# Altium schematic sheet 2_shkb_lite_mini_bt_hub.SchDoc: =ProjectTitle
size A4; Address1: github.com/4pplet/SHKB; Address2: Licence: CERN-OHL-S; SheetNumber: 2; SheetTotal: 7
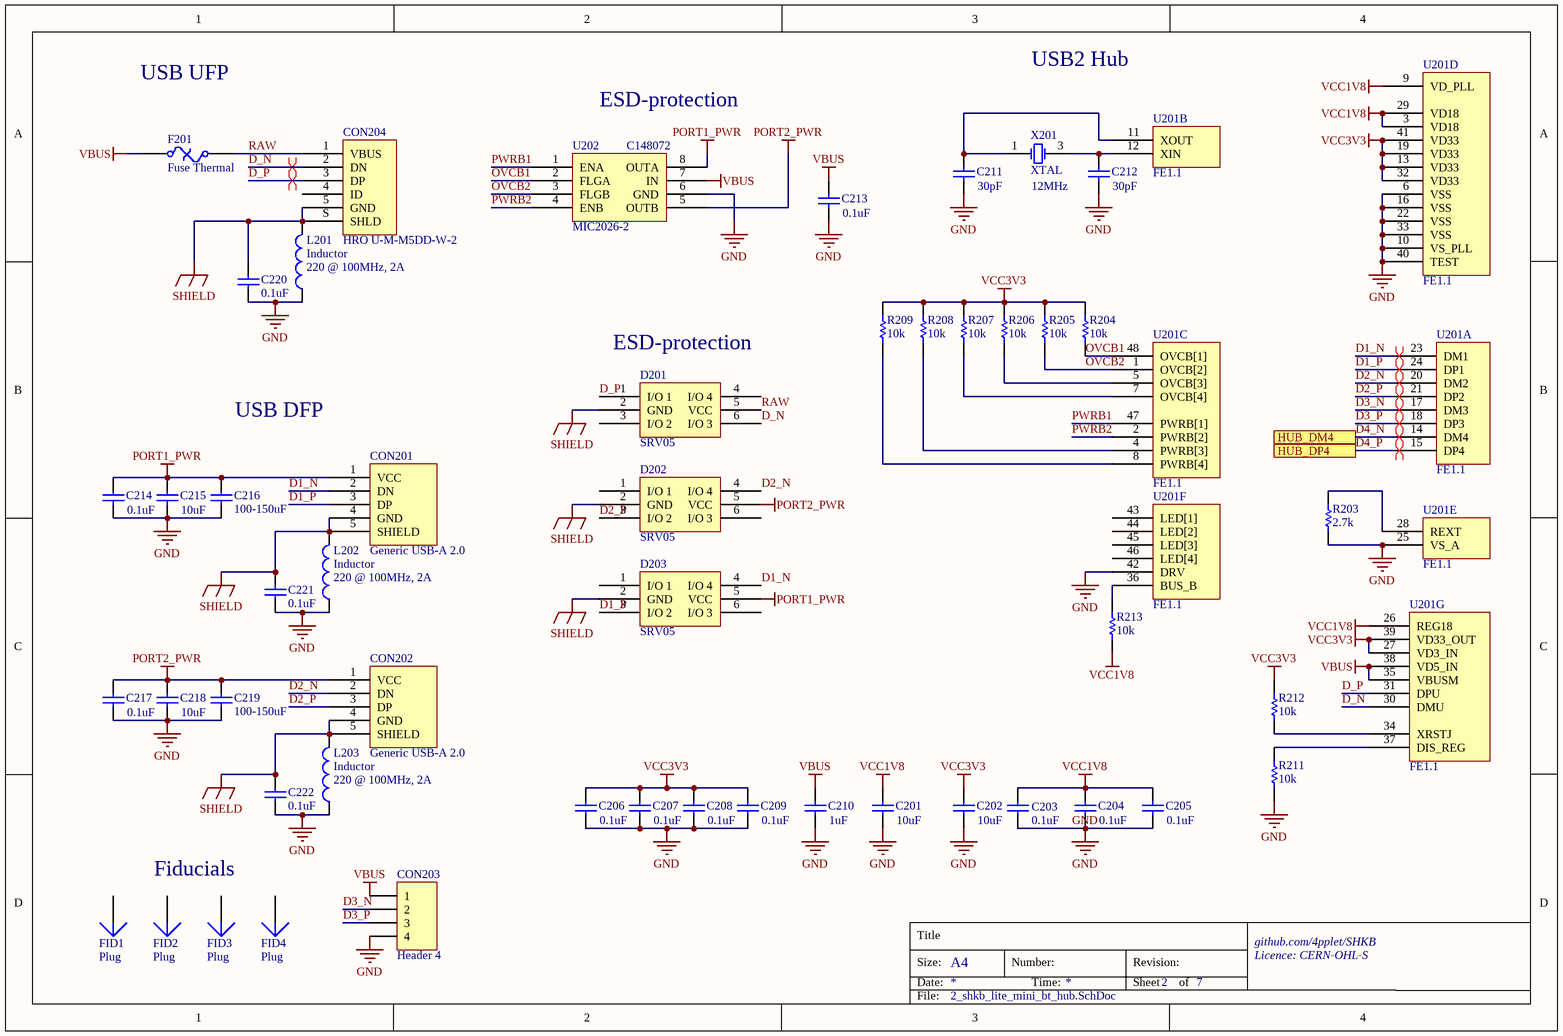
[diagram p0: 2_shkb_lite_mini_bt_hub.SchDoc]

## Parts
C201  value 10uF  [C0603[1608]]
C202  value 10uF  [C0603[1608]]
C203  value 0.1uF  [C0603[1608]]
C204  value 0.1uF  [C0603[1608]]
C205  value 0.1uF  [C0603[1608]]
C206  value 0.1uF  [C0603[1608]]
C207  value 0.1uF  [C0603[1608]]
C208  value 0.1uF  [C0603[1608]]
C209  value 0.1uF  [C0603[1608]]
C210  value 1uF  [C0603[1608]]
C211  value 30pF  [C0603[1608]]
C212  value 30pF  [C0603[1608]]
C213  value 0.1uF  [C0603[1608]]
C214  value 0.1uF  [C0603[1608]]
C215  value 10uF  [C0603[1608]]
C216  value 100-150uF  [C_9L_9M + THT]
C217  value 0.1uF  [C0603[1608]]
C218  value 10uF  [C0603[1608]]
C219  value 100-150uF  [C_9L_9M + THT]
C220  value 0.1uF  [C0603[1608]]
C221  value 0.1uF  [C0603[1608]]
C222  value 0.1uF  [C0603[1608]]
CON201  Generic USB-A 2.0  [Jing 903-231A2031S10100]
CON202  Generic USB-A 2.0  [Jing 903-231A2031S10100]
CON203  Header 4  [HDR1X4]  (no BOM)
CON204  HRO U-M-M5DD-W-2  [HRO U-M-M5DD-W-2]
D201  SRV05  [SOT-23-6]
D202  SRV05  [SOT-23-6]
D203  SRV05  [SOT-23-6]
F201  Fuse Thermal  [C1206[3216]]
FID1  Plug  [Fiducial_Nordic]  (no BOM)
FID2  Plug  [Fiducial_Nordic]  (no BOM)
FID3  Plug  [Fiducial_Nordic]  (no BOM)
FID4  Plug  [Fiducial_Nordic]  (no BOM)
L201  Inductor  value 220 @ 100MHz, 2A  [L0603[1608]]
L202  Inductor  value 220 @ 100MHz, 2A  [L0603[1608]]
L203  Inductor  value 220 @ 100MHz, 2A  [L0603[1608]]
R203  value 2.7k  [R0603[1608]]
R204  value 10k  [R0603[1608]]
R205  value 10k  [R0603[1608]]
R206  value 10k  [R0603[1608]]
R207  value 10k  [R0603[1608]]
R208  value 10k  [R0603[1608]]
R209  value 10k  [R0603[1608]]
R211  value 10k  [R0603[1608]]
R212  value 10k  [R0603[1608]]
R213  value 10k  [R0603[1608]]
U201  FE1.1  [FE1.1 LQFP48]  (parts A,B,C,D,E,F,G of 7)
U202  MIC2026-2  [SOIC-8]
X201  XTAL  value 12MHz  [XTAL-3225]

## Ports
HUB_DM4, HUB_DP4

## Nets
GND: C201.1 C202.1 C203.1 C204.1 C205.1 C206.1 C207.1 C208.1 C209.1 C210.1 C211.1 C212.1 C213.1 C214.1 C215.1 C216.2 C217.1 C218.1 C219.2 C220.1 C221.1 C222.1 CON203.4 L201.1 L202.1 L203.1 R203.1 R211.1 U201.6(VSS) U201.10(VS_PLL) U201.16(VSS) U201.22(VSS) U201.25(VS_A) U201.33(VSS) U201.40(TEST) U201.42(DRV) U202.6(GND) X201.2(GND) X201.4(GND)
PORT1_PWR: C214.2 C215.2 C216.1 CON201.1(VCC) D203.5(VCC) U202.8(OUTA)
PORT2_PWR: C217.2 C218.2 C219.1 CON202.1(VCC) D202.5(VCC) U202.5(OUTB)
SHIELD: C220.2 C221.2 C222.2 CON201.4(GND) CON201.5(SHIELD) CON202.4(GND) CON202.5(SHIELD) CON204.5(GND) CON204.S(SHLD) D201.2(GND) D202.2(GND) D203.2(GND) L201.2 L202.2 L203.2
VBUS: C210.2 C213.2 CON203.1 F201.1 U201.35(VBUSM) U201.38(VD5_IN) U202.7(IN)
VCC1V8: C201.2 C203.2 C204.2 C205.2 R213.1 U201.3(VD18) U201.9(VD_PLL) U201.26(REG18) U201.29(VD18)
VCC3V3: C202.2 C206.2 C207.2 C208.2 C209.2 R204.2 R205.2 R206.2 R207.2 R208.2 R209.2 R212.2 U201.13(VD33) U201.19(VD33) U201.27(VD3_IN) U201.32(VD33) U201.39(VD33_OUT) U201.41(VD33)
D1_N: CON201.2(DN) D203.4(I/O_4) U201.23(DM1)
D1_P: CON201.3(DP) D203.3(I/O_2) U201.24(DP1)
D2_N: CON202.2(DN) D202.4(I/O_4) U201.20(DM2)
D2_P: CON202.3(DP) D202.3(I/O_2) U201.21(DP2)
D3_N: CON203.2 U201.17(DM3)
D3_P: CON203.3 U201.18(DP3)
D4_N: U201.14(DM4) ; port HUB_DM4
D4_P: U201.15(DP4) ; port HUB_DP4
D_N: CON204.2(DN) D201.6(I/O_3) U201.30(DMU)
D_P: CON204.3(DP) D201.1(I/O_1) U201.31(DPU)
OVCB1: R204.1 U201.48(OVCB[1]) U202.2(FLGA)
OVCB2: R205.1 U201.1(OVCB[2]) U202.3(FLGB)
PWRB1: U201.47(PWRB[1]) U202.1(ENA)
PWRB2: U201.2(PWRB[2]) U202.4(ENB)
RAW: CON204.1(VBUS) D201.5(VCC) F201.2
NetC211_2: C211.2 U201.11(XOUT) X201.1(OSC1)
NetC212_2: C212.2 U201.12(XIN) X201.3(OSC2)
NetR203_2: R203.2 U201.28(REXT)
NetR206_1: R206.1 U201.5(OVCB[3])
NetR207_1: R207.1 U201.7(OVCB[4])
NetR208_1: R208.1 U201.4(PWRB[3])
NetR209_1: R209.1 U201.8(PWRB[4])
NetR211_2: R211.2 U201.37(DIS_REG)
NetR212_1: R212.1 U201.34(XRSTJ)
NetR213_2: R213.2 U201.36(BUS_B)

Not connected (* = marked no-connect by the designer): CON204 4(ID); D201 3(I/O_2) 4(I/O_4); D202 1(I/O_1) 6(I/O_3); D203 1(I/O_1) 6(I/O_3); FID1 1; FID2 1; FID3 1; FID4 1; U201 43(LED[1]) 44(LED[2]) 45(LED[3]) 46(LED[4])

## Layout directives
differential pair: D1_N, D1_P, D2_N, D2_P, D3_N, D3_P, D4_N, D4_P, D_N, D_P

## Notes on the sheet
- USB UFP
- ESD-protection
- USB2 Hub
- (near U202) C148072
- (near D201) ESD-protection
- USB DFP
- Fiducials
- Title
- Size:
- Date:
- A4
- Number:
- Time:
- Revision:
- Sheet
- of
- File:

## Library data of the parts
C201 C202 C215 C218 = Cap: Capacitor; MRF.Part: CL10A106KP8NNNC; LCSC MFG: Samsung Electro-Mechanics; Version: 0603 imperial; LCSC Part #: C19702
C203-C209 C213 C214 C217 C220-C222 = Cap: Capacitor; MRF.Part: CC0603KRX7R9BB104; MFG: KEMET; MFGPN: C0603C104M5RACTU; LCSC MFG: YAGEO; Version: 0603 imperial; LCSC Part #: C14663
C210 = Cap: Capacitor; MRF.Part: CL10A105KB8NNNC; MFG: KEMET; MFGPN: C0603C105K4RACTU; LCSC MFG: Samsung Electro-Mechanics; Version: 0603 imperial; LCSC Part #: C15849
C211 C212 = Cap: Capacitor; MRF.Part: CL10C300JB8NNNC; LCSC MFG: Samsung Electro-Mechanics; Version: 0603 imperial; LCSC Part #: C22397
C216 C219 = Cap: Capacitor; MRF.Part: OVZ101M1CTR-0606; LCSC MFG: Lelon; Version: SMD - 9L or 9M; LCSC Part #: C134878
CON201 CON202 = Generic USB-A 2.0: MRF.Part: 903-231A2031S10100; LCSC MFG: Jing Extension of the Electronic Co.; LCSC Part #: C42646
CON203 = Header 4: Header, 4-Pin
CON204 = HRO U-M-M5DD-W-2: LCSC MFG: Korean Hroparts Elec; LCSC Part #: C879746; MRF.Part: U-M-M5DD-W-2
D201-D203 = SRV05: MRF.Part: SRV05-4-P-T7; LCSC MFG: ProTek Devices; LCSC Part #: C85364
F201 = Fuse Thermal: Thermal Fuse; MRF.Part: ASMD1206-050; MFG: Bel Fuse Inc.; MFGPN: 0ZCJ0050FF2G; LCSC MFG: Shenzhen JDT Fuse; LCSC Part #: C135338
L201-L203 = Inductor: MRF.Part: BLM18KG331SN1D; MFG: Murata Electronics North America; MFGPN: BLM18KG221SN1D; LCSC MFG: Murata Electronics; Version: 0603 imperial; LCSC Part #: C85832
R203 = Res1: Resistor; MRF.Part: 0603WAF2701T5E; LCSC MFG: UNI-ROYAL(Uniroyal Elec); Version: 0603 imperial; LCSC Part #: C13167
R204-R209 R211-R213 = Res1: Resistor; MRF.Part: 0603WAF1002T5E; MFG: Vishay Dale; MFGPN: RCA060310K0FKEA; LCSC MFG: Uniroyal Elec; Version: 0603 imperial; LCSC Part #: C25804
U201 = FE1.1: LCSC MFG: Terminus Tech; LCSC Part #: C28958; MRF.Part: FE1.1
U202 = MIC2026-2: MRF.Part: MIC2026-2YM-TR; LCSC MFG: Microchip Tech; LCSC Part #: C148072
X201 = XTAL: Crystal Oscillator; MRF.Part: X322512MSB4SI; LCSC MFG: Yangxing Tech; LCSC Part #: C9002